# EAGLE design Manual_Final_1.2 (EAGLE 9.1.3)
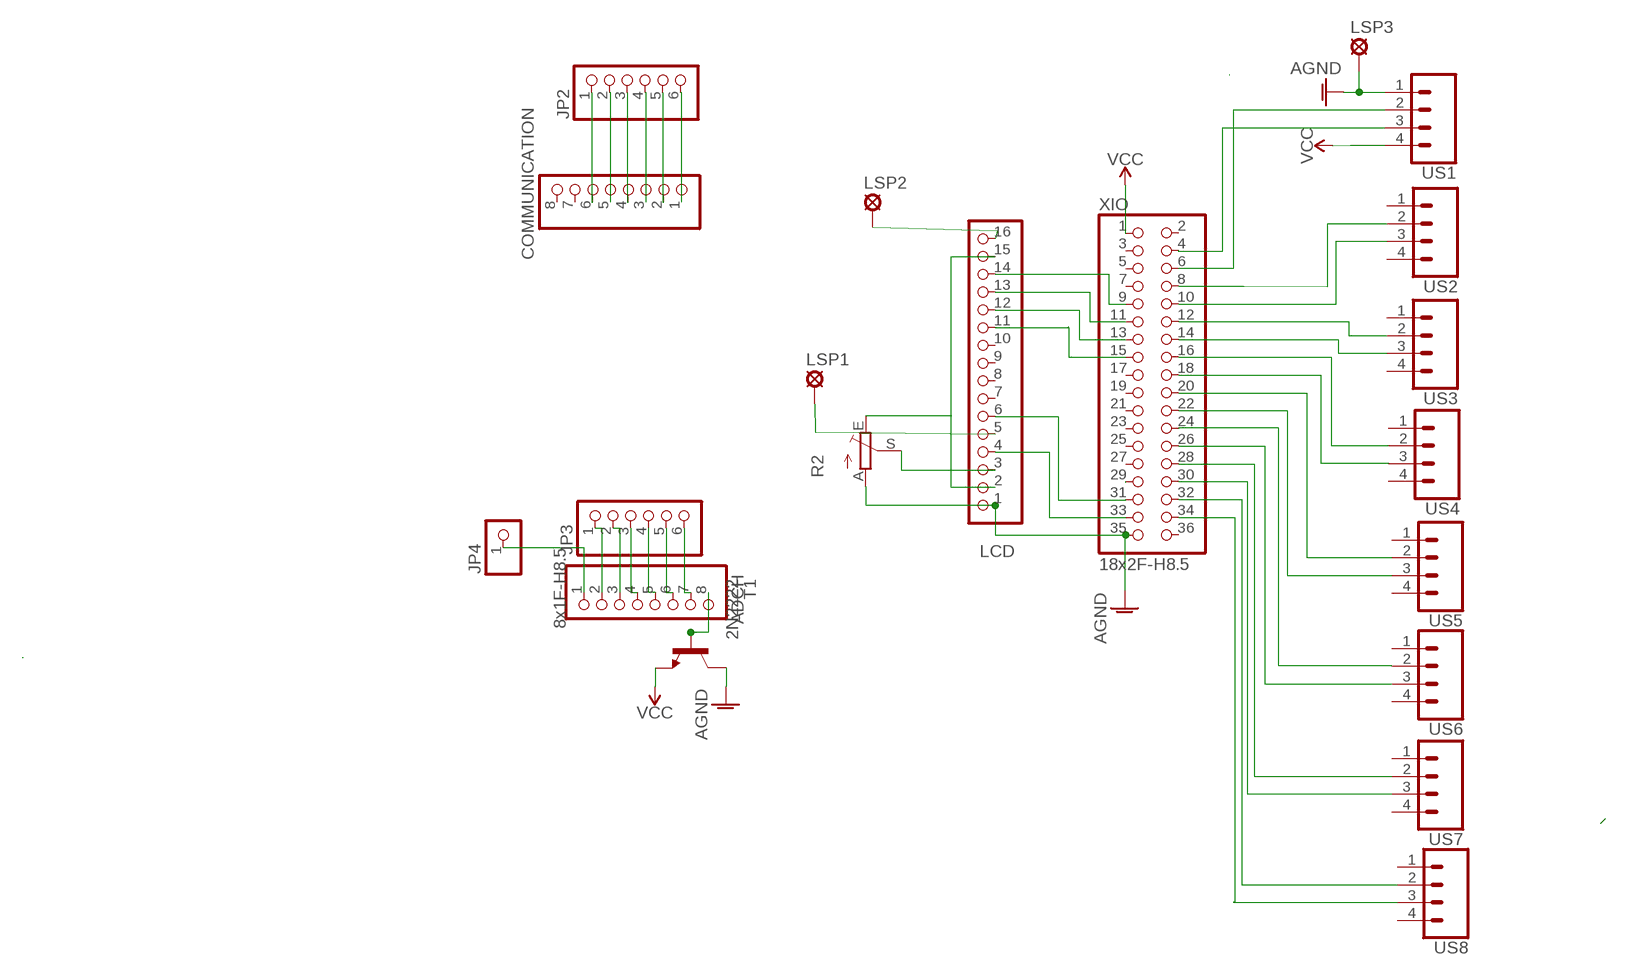
[diagram p0: schematic, sheet 1]

## Parts
ADCH  8x1F-H8.5  PINHD-1X8  [1X08]
COMMUNICATION  8x1F-H8.5  PINHD-1X8  [1X08]
JP2  PINHD-1X6  [1X06]
JP3  PINHD-1X6  [1X06]
JP4  PINHD-1X1  [1X01]
LCD  PINHD-1X16  [1X16]
LSP1  SE14  [SE14]
LSP2  SE14  [SE14]
LSP3  SE14  [SE14]
R2  TRIM_EU-RS3  [RS3]
T1  2N2222  [TO92-EBC-OVAL]
US1  CONN_04LOCK_LONGPADS  [1X04_LOCK_LONGPADS]
US2  CONN_04LOCK_LONGPADS  [1X04_LOCK_LONGPADS]
US3  CONN_04LOCK_LONGPADS  [1X04_LOCK_LONGPADS]
US4  CONN_04LOCK_LONGPADS  [1X04_LOCK_LONGPADS]
US5  CONN_04LOCK_LONGPADS  [1X04_LOCK_LONGPADS]
US6  CONN_04LOCK_LONGPADS  [1X04_LOCK_LONGPADS]
US7  CONN_04LOCK_LONGPADS  [1X04_LOCK_LONGPADS]
US8  CONN_04LOCK_LONGPADS  [1X04_LOCK_LONGPADS]
XIO  18x2F-H8.5  PINHD-2X18  [2X18]

## Nets
AGND: LCD.1 LSP3.MP R2.A T1.C US1.1 XIO.35
N$3: ADCH.8 T1.B
N$5: COMMUNICATION.1 JP2.6
N$6: US1.3 XIO.4
N$7: US1.2 XIO.6
N$8: US2.2 XIO.8
N$9: US2.3 XIO.10
N$10: US3.2 XIO.12
N$11: US5.2 XIO.20
N$12: US4.2 XIO.16
N$14: US4.3 XIO.18
N$15: US5.3 XIO.22
N$17: US6.2 XIO.24
N$18: US6.3 XIO.26
N$19: US7.2 XIO.28
N$20: US7.3 XIO.30
N$21: US8.2 XIO.32
N$22: US3.3 XIO.14
N$23: US8.3 XIO.34
N$24: LCD.2 LCD.15 R2.E
N$25: LCD.3 R2.S
N$26: XIO.29
N$27: LCD.4 XIO.33
N$28: LCD.6 XIO.31
N$29: LCD.14 XIO.9
N$30: LCD.13 XIO.11
N$31: LCD.12 XIO.13
N$32: COMMUNICATION.2 JP2.5
N$33: COMMUNICATION.3 JP2.4
N$34: COMMUNICATION.4 JP2.3
N$35: COMMUNICATION.5 JP2.2
N$36: COMMUNICATION.6 JP2.1
N$37: ADCH.7 JP3.6
N$38: ADCH.6 JP3.5
N$39: LCD.16 LSP2.MP
N$40: LCD.5 LSP1.MP
N$41: LCD.11 XIO.15
N$42: ADCH.5 JP3.4
N$43: ADCH.4 JP3.3
N$44: ADCH.3 JP3.2
N$45: ADCH.2 JP3.1
N$46: ADCH.1 JP4.1
VCC: T1.E US1.4 XIO.1
Unconnected: COMMUNICATION.7 COMMUNICATION.8 LCD.7 LCD.8 LCD.9 LCD.10 US2.1 US2.4 US3.1 US3.4 US4.1 US4.4 US5.1 US5.4 US6.1 US6.4 US7.1 US7.4 US8.1 US8.4 XIO.2 XIO.3 XIO.5 XIO.7 XIO.17 XIO.19 XIO.21 XIO.23 XIO.25 XIO.27 XIO.36

## Library data of the parts
ADCH COMMUNICATION = SmartPrj:PINHD-1X8: PIN HEADER
JP2 JP3 = adafruit:PINHD-1X6: PIN HEADER
JP4 = pinhead:PINHD-1X1: PIN HEADER
LCD = pinhead:PINHD-1X16: PIN HEADER
LSP1-LSP3 = solpad:SE14: SOLDER PAD E1553, drill 1,4mm, distributor Buerklin, 07F820
R2 = pot:TRIM_EU-: POTENTIOMETER
T1 = adafruit:2N2222: NPN TRANSISTOR Big oval pads
US1-US8 = SparkFun-Connectors:CONN_04: Multi connection point. Often used as Generic Header-pin footprint for 0.1 inch spaced/style header connections On any of the 0.1 inch spaced packages, you can populate with these: Break Away Headers - Straight <https://www.sparkfun.com/products/116> (PRT-00116) Break Away Male Headers - Right Angle <https://www.sparkfun.com/products/553> (PRT-00553) Female Headers <https://www.sparkfun.com/products/115> (PRT-00115) Break Away Headers - Machine Pin <https://www.sparkfun.com/products/117> (PRT-00117) Break Away Female Headers - Swiss Machine Pin <https://www.sparkfun.com/products/743> (PRT-00743) For SCREWTERMINALS and SPRING TERMINALS visit here: Screw Terimnals on SparkFun.com <https://www.sparkfun.com/search/results?term=Screw+Terminals> (5mm/3.5mm/2.54mm spacing) This device is also useful as a general connection point to wire up your design to another part of your project. Our various solder wires solder well into these plated through hole pads. Hook-Up Wire - Assortment (Stranded, 22 AWG) <https://www.sparkfun.com/products/11375> (PRT-11375) Hook-Up Wire - Assortment (Solid Core, 22 AWG) <https://www.sparkfun.com/products/11367> (PRT-11367) View the entire wire category on our website here <https://www.sparkfun.com/categories/141> Special notes: Molex polarized connector foot print use with SKU : PRT-08231 with associated crimp pins and housings. 1MM SMD Version SKU: PRT-10208; PROD_ID: CONN-09696
XIO = SmartPrj:PINHD-2X18: PIN HEADER

## Net classes
0 default: width 0.203 mm, drill 0.406 mm, clearance 0.203 mm
1 USB: width 0.203 mm, drill 0.406 mm, clearance 0.203 mm
2 gnd: width 0.203 mm, drill 0.406 mm, clearance 0.203 mm
3 usbvcc: width 0.203 mm, drill 0.406 mm, clearance 0.203 mm
4 USBpair: width 0.254 mm, drill 0.406 mm, clearance 0.61 mm

## Board
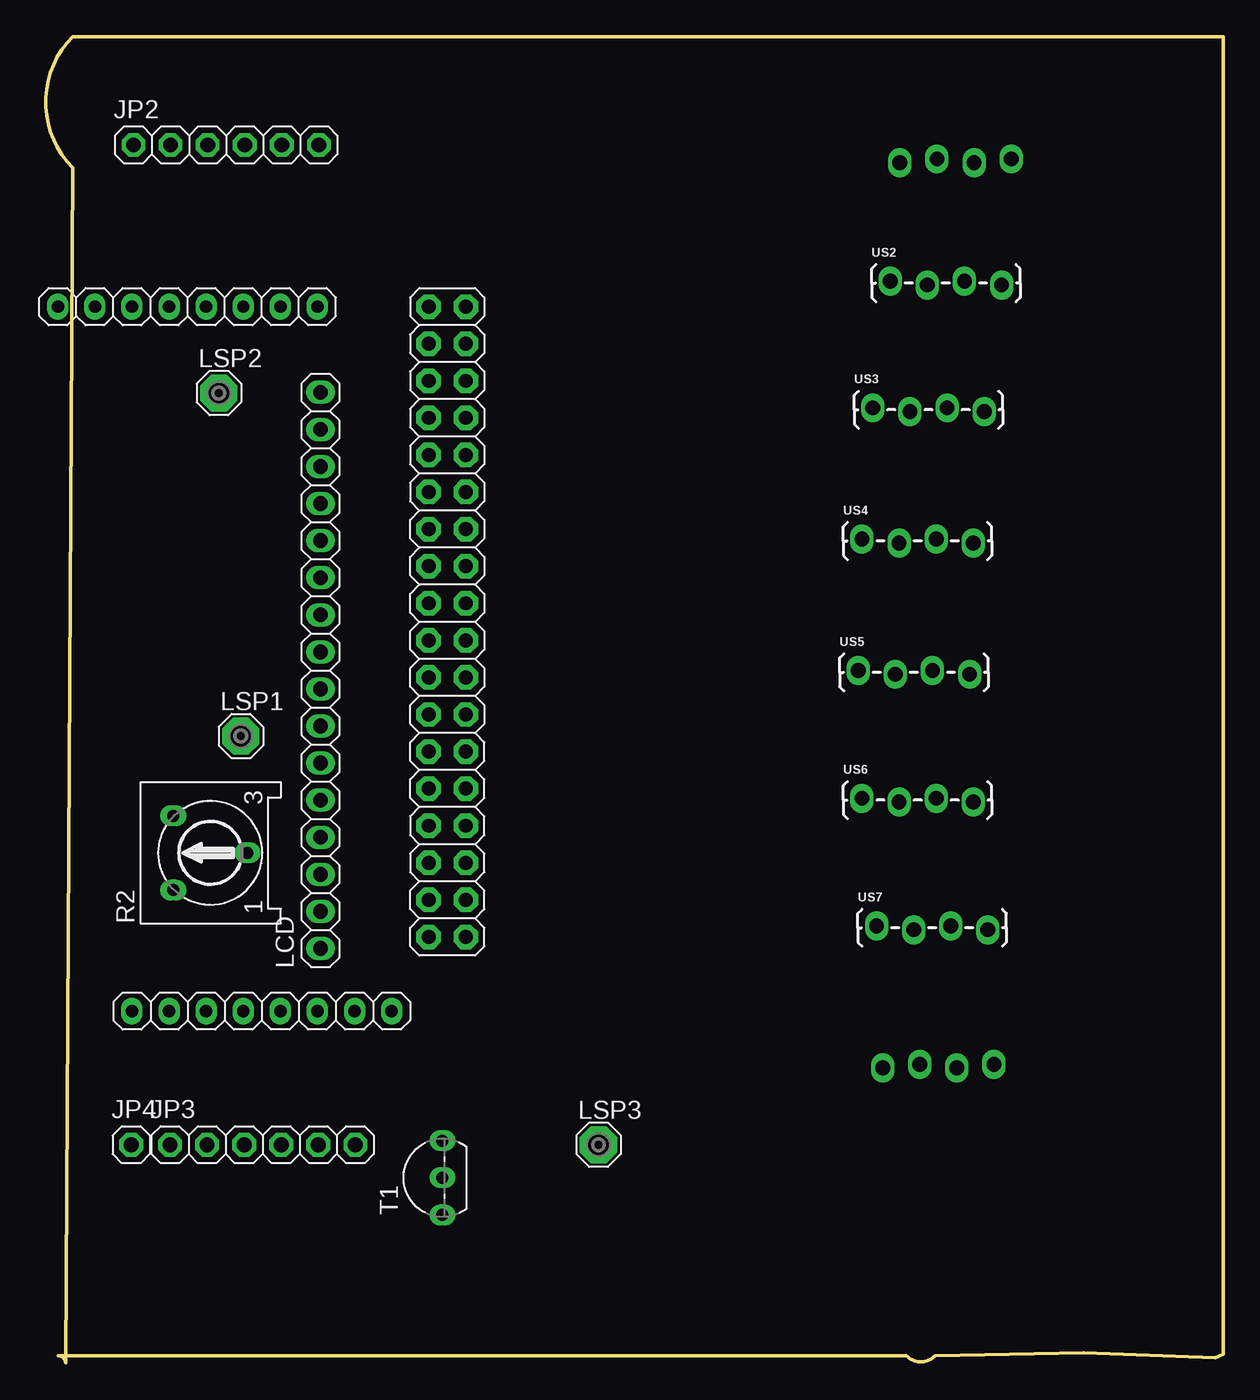
[diagram p1: board, top side]
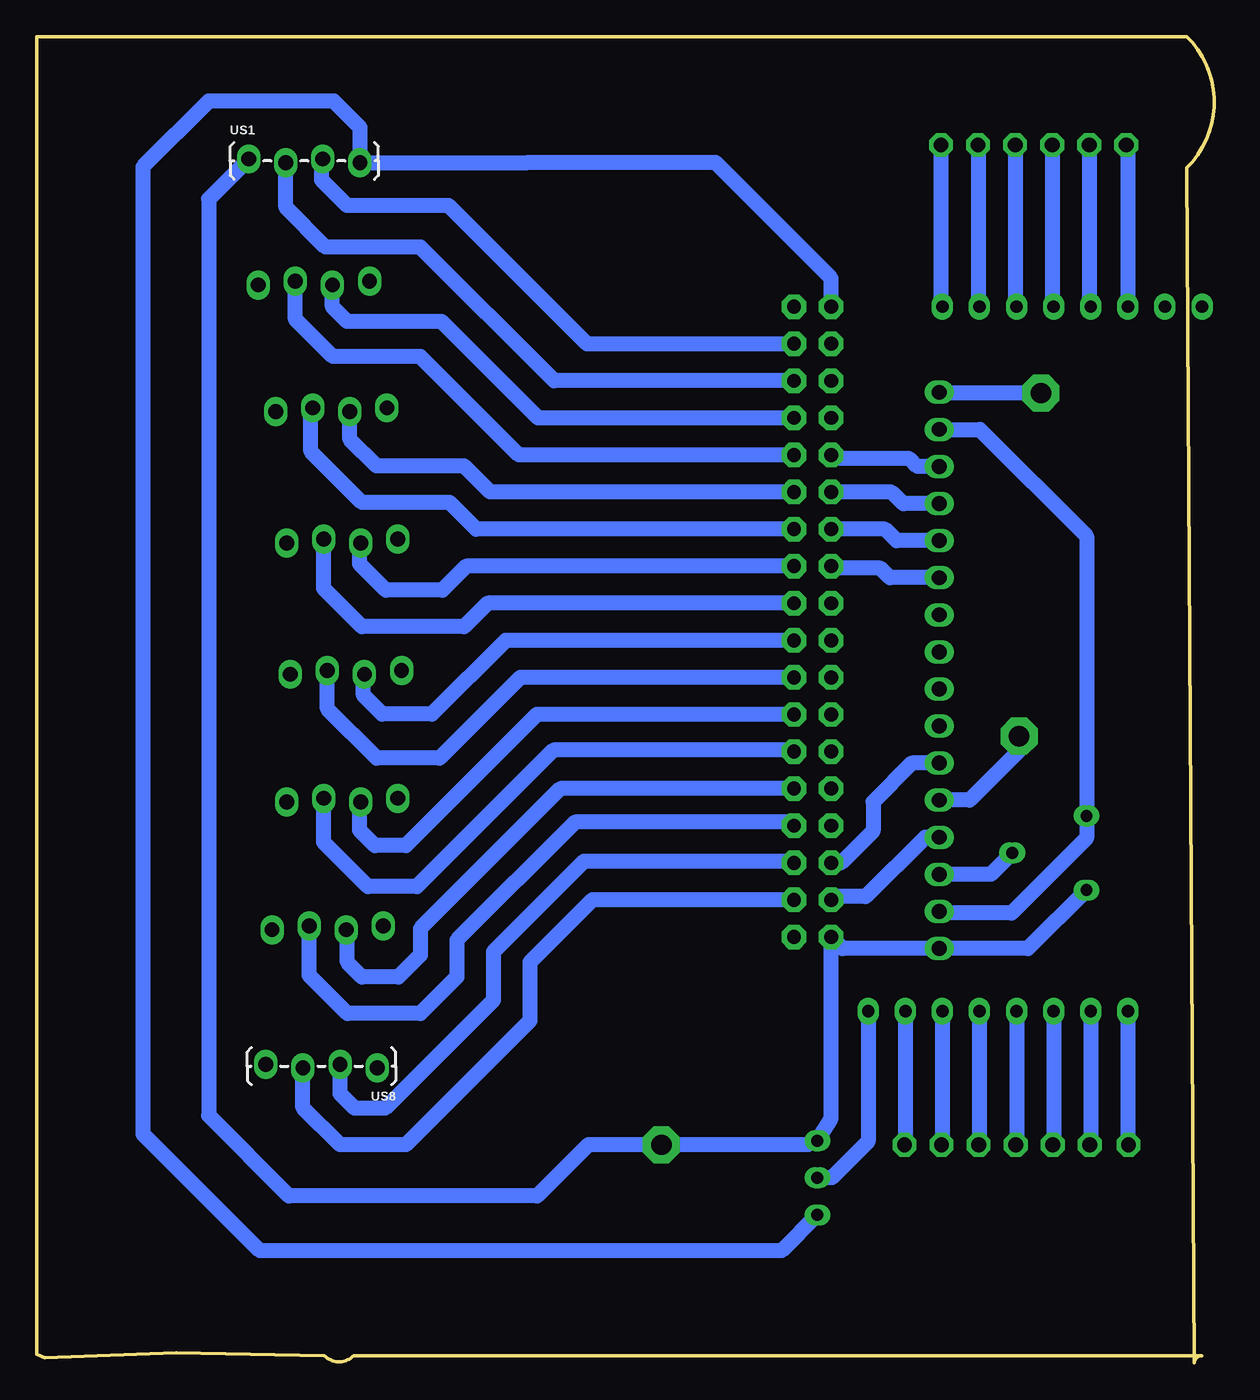
[diagram p2: board, bottom side, seen from below]

Size 80.65 x 90.88 mm. Coordinates in mm from the lower left corner, seen from the top.
Outline: 69.56,90.88 80.65,90.86 80.65,0.6 80.09,0.38 71.09,0.7 60.93,0.5 arc-90 58.93,0.5 0.86,0.5 arc-90 1.36,0 1.86,81.88 arc-90 1.86,90.88 69.56,90.88
Copper layers (1*16): Top 0.035mm / dielectric 1.6mm / Bottom 0.035mm
Design rules "default *": minimum track width 0.5mm, minimum drill 16mil, track to track 0.8mm, track to pad 0.8mm, pad to pad 8mil, via to via 8mil, smd to smd 6mil, copper to edge 20mil, drill to drill 12mil, minimum pad ring 12mil, minimum via ring 8mil, stop-mask expansion 2mil, vias tented up to drill 25mil, thermal gap 8mil

### Footprints (pad centres in the part's own frame; a part is rotated, then mirrored left to right if it is on the bottom)
1X08 = drill 0.85 pad 1.422 long: 1 -8.89,0; 2 -6.35,0; 3 -3.81,0; 4 -1.27,0; 5 1.27,0; 6 3.81,0; 7 6.35,0; 8 8.89,0
1X06 = drill 1.016 octagon: 1 -6.35,0; 2 -3.81,0; 3 -1.27,0; 4 1.27,0; 5 3.81,0; 6 6.35,0
1X01 = drill 1.016 octagon: 1 0,0
1X16 = drill 1.016 long: 1 -19.05,0; 2 -16.51,0; 3 -13.97,0; 4 -11.43,0; 5 -8.89,0; 6 -6.35,0; 7 -3.81,0; 8 -1.27,0; 9 1.27,0; 10 3.81,0; 11 6.35,0; 12 8.89,0; 13 11.43,0; 14 13.97,0; 15 16.51,0; 16 19.05,0
SE14 = drill 1.397 pad 2.54 octagon: MP 0,0
RS3 = drill 0.813 long: A -2.54,2.54; E 2.54,2.54; S 0,-2.54
TO92-EBC-OVAL = drill 0.813 long: B 0,-1.27; C 2.54,-1.27; E -2.54,-1.27
1X04_LOCK_LONGPADS = drill 1.016 long: 1 0,0; 2 2.54,-0.254; 3 5.08,0; 4 7.62,-0.254
2X18 = drill 0.95 pad 1.676 octagon: 1 -21.59,-1.27; 2 -21.59,1.27; 3 -19.05,-1.27; 4 -19.05,1.27; 5 -16.51,-1.27; 6 -16.51,1.27; 7 -13.97,-1.27; 8 -13.97,1.27; 9 -11.43,-1.27; 10 -11.43,1.27; 11 -8.89,-1.27; 12 -8.89,1.27; 13 -6.35,-1.27; 14 -6.35,1.27; 15 -3.81,-1.27; 16 -3.81,1.27; 17 -1.27,-1.27; 18 -1.27,1.27; 19 1.27,-1.27; 20 1.27,1.27; 21 3.81,-1.27; 22 3.81,1.27; 23 6.35,-1.27; 24 6.35,1.27; 25 8.89,-1.27; 26 8.89,1.27; 27 11.43,-1.27; 28 11.43,1.27; 29 13.97,-1.27; 30 13.97,1.27; 31 16.51,-1.27; 32 16.51,1.27; 33 19.05,-1.27; 34 19.05,1.27; 35 21.59,-1.27; 36 21.59,1.27

### Placement (x,y rotation side)
ADCH  14.8,24.11 0 top
COMMUNICATION  9.72,72.37 180 top
JP2  12.36,83.45 0 top
JP3  14.86,14.95 0 top
JP4  5.86,14.95 0 top
LCD  18.82,47.45 90 top
LSP1  13.36,42.95 0 top
LSP2  11.86,66.45 0 top
LSP3  37.86,14.95 0 top
R2  11.28,34.95 90 top
T1  25.9,12.69 90 top
US1  66.12,82.49 0 bottom
US2  57.84,74.11 0 top
US3  56.65,65.44 0 top
US4  55.9,56.44 0 top
US5  55.65,47.44 0 top
US6  55.9,38.69 0 top
US7  56.9,29.94 0 top
US8  57.32,20.21 180 bottom
XIO  27.5,50.78 270 top

### Tracks (layer width: path | path; a pad name or v marks a point on that pad's centre or on a via)
AGND
  Bottom 1.016: US1.1 68.86,79.75 68.86,16.95 63.36,11.45 46.36,11.45 42.86,14.95 LSP3.MP 27.83,14.95 T1.C 26.23,16.73 XIO.35 25.44,28.4 LCD.1 12.75,28.4 R2.A
N$3
  Bottom 1.016: ADCH.8 23.69,15.17 26.17,12.69 T1.B
N$5
  Bottom 1.016: JP2.6 18.71,72.47 COMMUNICATION.1
N$6
  Bottom 1.016: XIO.4 42.95,69.83 52.42,79.3 59.38,79.3 61.12,81.05 61.12,82.41 US1.3
N$7
  Bottom 1.016: XIO.6 45.2,67.29 54.36,76.45 60.86,76.45 63.58,79.17 US1.2
N$8
  Bottom 1.016: XIO.8 46.29,64.75 52.9,71.36 59.38,71.36 60.38,72.36 US2.2
N$9
  Bottom 1.016: XIO.10 47.62,62.21 54.36,68.95 60.36,68.95 62.92,71.51 US2.3
N$10
  Bottom 1.016: XIO.12 49.58,59.67 51.36,61.45 57.36,61.45 59.19,63.28 US3.2
N$11
  Bottom 1.016: XIO.20 48.52,49.51 53.58,44.45 56.97,44.45 58.27,45.75 58.27,47.11 US5.2
N$12
  Bottom 1.016: XIO.16 51.22,54.59 52.86,52.95 56.72,52.95 58.52,54.75 58.52,56.11 US4.2
N$14
  Bottom 1.016: XIO.18 49.76,52.05 51.36,50.45 58.36,50.45 60.98,53.07 US4.3
N$15
  Bottom 1.016: XIO.22 47.52,46.97 53.04,41.45 57.36,41.45 60.73,44.82 US5.3
N$17
  Bottom 1.016: XIO.24 46.38,44.43 55.36,35.45 57.47,35.45 58.52,36.5 58.52,38.36 US6.2
N$18
  Bottom 1.016: US6.3 60.98,35.66 57.95,32.63 54.61,32.63 45.24,42 28.87,42 XIO.26
N$19
  Bottom 1.016: XIO.28 44.77,39.35 54.36,29.76 54.36,27.95 55.86,26.45 58.36,26.45 59.36,27.45 59.36,29.61 US7.2
N$20
  Bottom 1.016: XIO.30 29.02,37.06 43.77,37.06 51.86,28.97 51.86,26.45 54.36,23.95 59.36,23.95 61.98,26.57 US7.3
N$21
  Bottom 1.016: US8.2 59.86,18.45 58.86,17.45 56.77,17.45 49.36,24.86 49.36,28.18 43.16,34.38 28.87,34.38 XIO.32
N$22
  Bottom 1.016: XIO.14 50.54,57.13 52.36,58.95 58.36,58.95 61.86,62.45 61.86,65.31 US3.3
N$23
  Bottom 1.016: XIO.34 42.58,31.73 46.86,27.45 46.86,23.45 55.36,14.95 59.86,14.95 62.4,17.49 US8.3
N$24
  Bottom 1.016: LCD.15 16.05,63.96 8.74,56.65 R2.E 8.74,35.96 13.87,30.83 18.71,30.83 LCD.2
N$25
  Bottom 1.016: R2.S 15.29,33.48 LCD.3
N$27
  Bottom 1.016: LCD.4 19.79,36.02 23.86,31.95 26.01,31.95 XIO.33
N$28
  Bottom 1.016: LCD.6 20.71,41.1 23.36,38.45 23.36,36.45 25.54,34.27 XIO.31
N$29
  Bottom 1.016: LCD.14 20.33,61.42 20.86,61.95 25.97,61.95 XIO.9
N$30
  Bottom 1.016: LCD.13 21.29,58.88 22.01,59.6 22.08,59.6 22.15,59.67 XIO.11
N$31
  Bottom 1.016: LCD.12 21.75,56.34 22.54,57.13 XIO.13
N$32
  Bottom 1.016: JP2.5 16.17,72.47 COMMUNICATION.2
N$33
  Bottom 1.016: JP2.4 13.63,72.47 COMMUNICATION.3
N$34
  Bottom 1.016: JP2.3 11.09,72.47 COMMUNICATION.4
N$35
  Bottom 1.016: JP2.2 8.55,72.47 COMMUNICATION.5
N$36
  Bottom 1.016: JP2.1 5.91,83.35 COMMUNICATION.6
N$37
  Bottom 1.016: ADCH.7 21.15,15.01 JP3.6
N$38
  Bottom 1.016: ADCH.6 18.61,15.01 JP3.5
N$39
  Bottom 1.016: LSP2.MP 18.77,66.45 LCD.16
N$40
  Bottom 1.016: LCD.5 16.75,38.56 13.36,41.95 LSP1.MP
N$41
  Bottom 1.016: LCD.11 22.21,53.8 22.86,54.45 26.09,54.45 XIO.15
N$42
  Bottom 1.016: ADCH.5 16.07,15.01 JP3.4
N$43
  Bottom 1.016: ADCH.4 13.53,15.01 JP3.3
N$44
  Bottom 1.016: ADCH.3 10.99,15.01 JP3.2
N$45
  Bottom 1.016: ADCH.2 8.45,15.01 JP3.1
N$46
  Bottom 1.016: ADCH.1 5.91,15 JP4.1
VCC
  Bottom 1.016: T1.E 29.62,7.7 65.36,7.7 73.36,15.7 73.36,81.95 68.86,86.45 60.28,86.45 58.5,84.66 US1.4 47,82.24 34.14,82.24 26.23,74.32 XIO.1